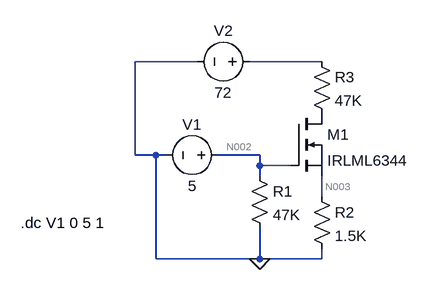
[diagram p0: schematic Prueba_Control_Voltaje.asc]
Prueba_Control_Voltaje.asc, the LTspice schematic file:
Version 4
SHEET 1 880 680
WIRE 192 32 96 32
WIRE 384 32 272 32
WIRE 96 176 96 32
WIRE 128 176 96 176
WIRE 144 176 128 176
WIRE 288 176 224 176
WIRE 288 192 288 176
WIRE 336 192 288 192
WIRE 288 208 288 192
WIRE 384 240 384 208
WIRE 128 336 128 176
WIRE 288 336 288 288
WIRE 288 336 128 336
WIRE 384 336 384 320
WIRE 384 336 288 336
FLAG 288 336 0
SYMBOL voltage 240 176 R90
WINDOW 0 -32 56 VBottom 2
WINDOW 3 32 56 VTop 2
SYMATTR InstName V1
SYMATTR Value 5
SYMBOL nmos 336 112 R0
SYMATTR InstName M1
SYMATTR Value IRLML6344
SYMBOL res 272 192 R0
SYMATTR InstName R1
SYMATTR Value 47K
SYMBOL res 368 224 R0
SYMATTR InstName R2
SYMATTR Value 1.5K
SYMBOL res 368 16 R0
SYMATTR InstName R3
SYMATTR Value 47K
SYMBOL voltage 288 32 R90
WINDOW 0 -32 56 VBottom 2
WINDOW 3 32 56 VTop 2
SYMATTR InstName V2
SYMATTR Value 72
TEXT -80 280 Left 2 !.dc V1 0 5 1

The netlist it stands for:
* Prueba_Control_Voltaje.asc
V1 N002 0 5
M1 P001 N002 N003 N003 IRLML6344
R1 N002 0 47K
R2 N003 0 1.5K
R3 N001 P001 47K
V2 N001 0 72
.model NMOS NMOS
.model PMOS PMOS
.lib standard.mos
.dc V1 0 5 1
.backanno
.end

* Results of the author's LTspice run, read from the files saved beside the schematic
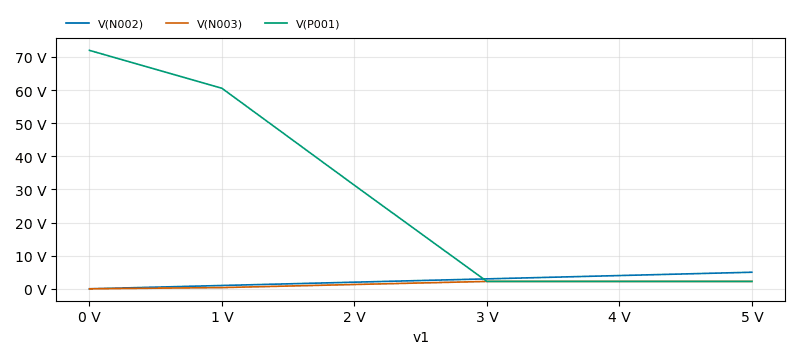
[diagram p1: DC transfer characteristic of Prueba_Control_Voltaje.asc, plotted from the saved traces]
* DC transfer characteristic, 1 run:
*   V(N002): 0 V at v1=0 V, 5 V at v1=5 V, min 0 V, max 5 V
*   V(N003): 1.425 µV at v1=0 V, 2.227 V at v1=5 V, min 1.425 µV, max 2.227 V
*   V(P001): 72 V at v1=0 V, 2.227 V at v1=5 V, min 2.227 V, max 72 V